# EAGLE design Ninja Sensors (EAGLE 5.11)
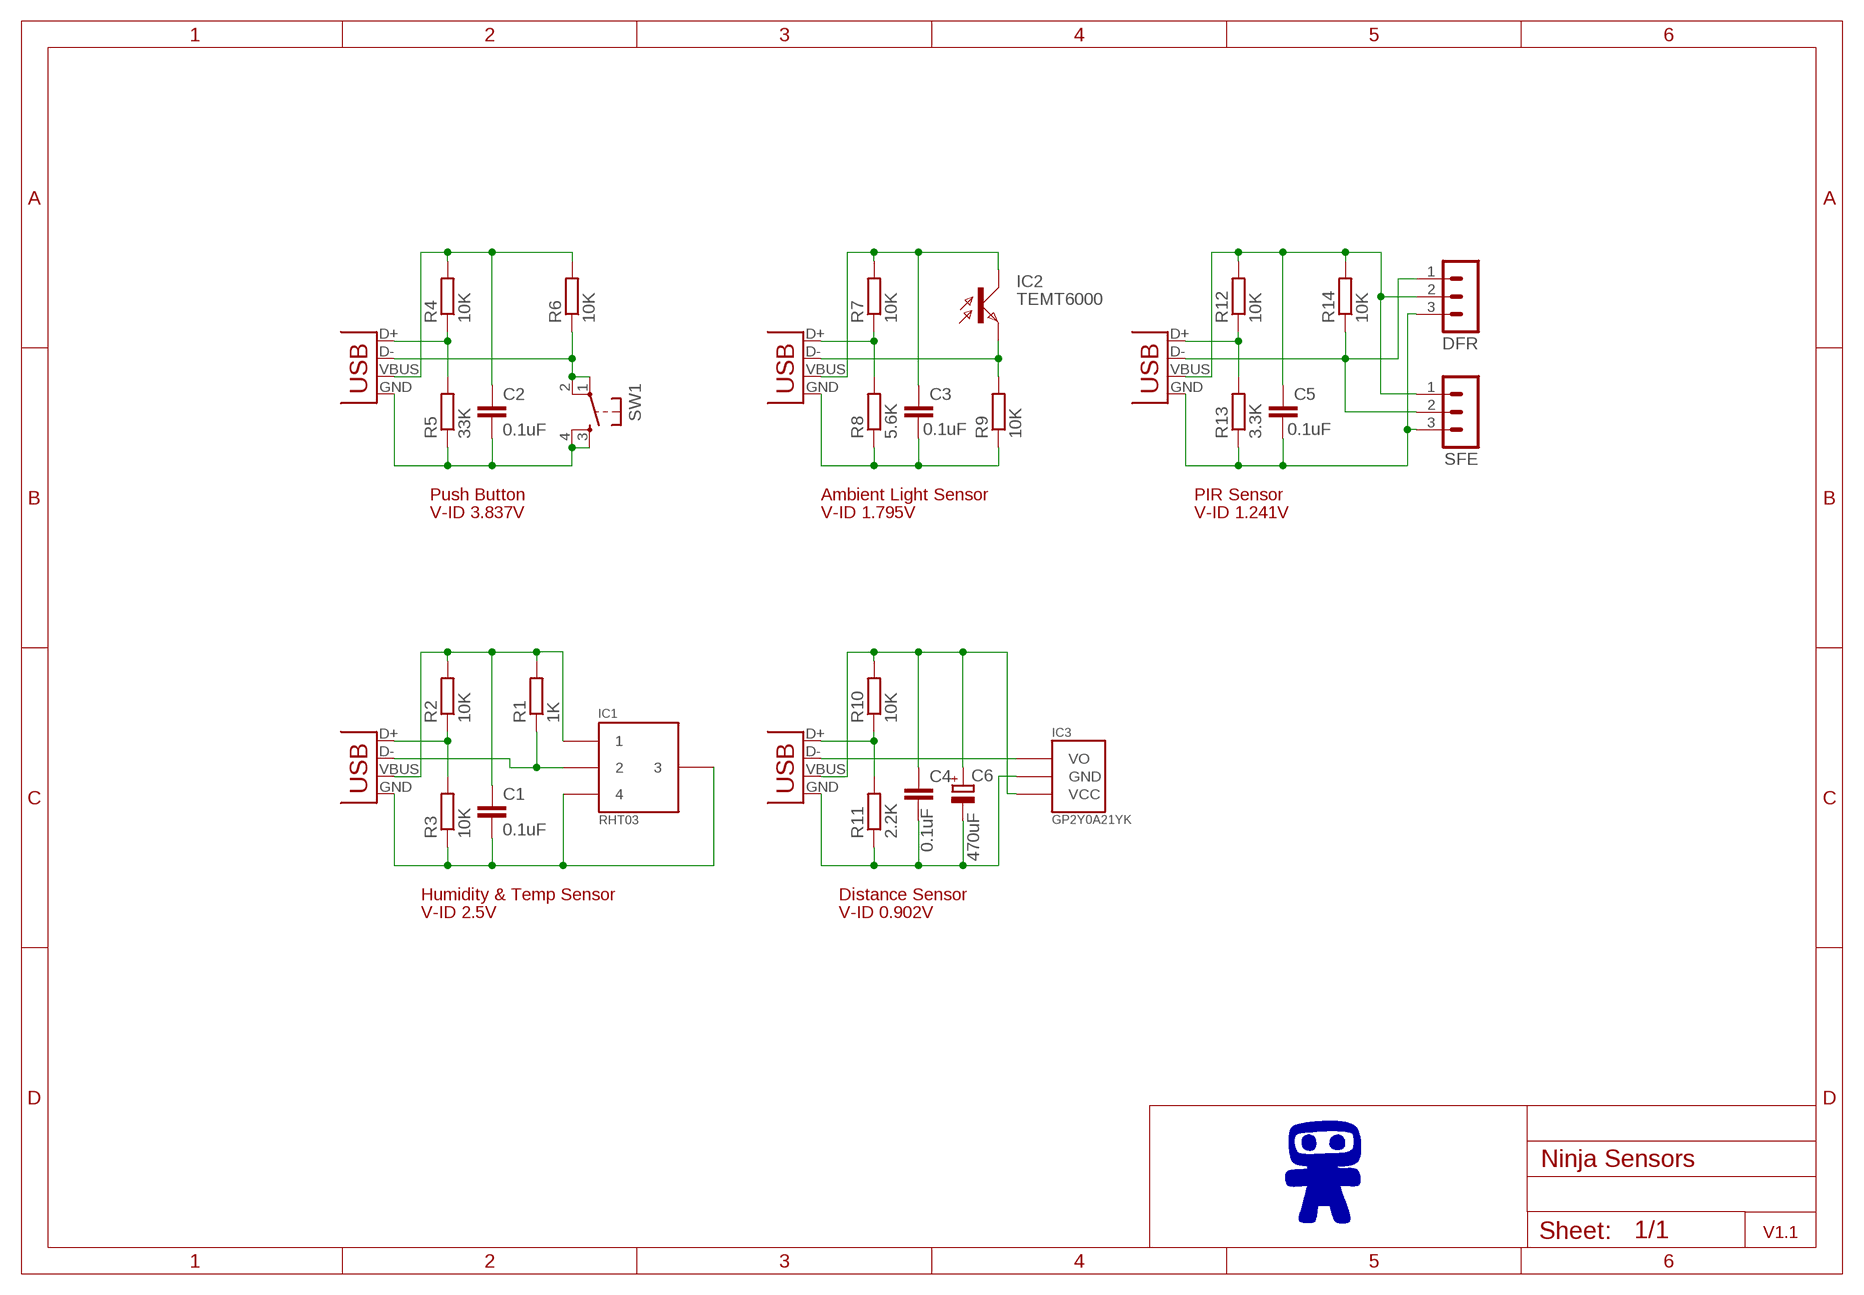
[diagram p0: schematic, sheet 1]

## Parts
C1  0.1uF  C-EUC0603  [C0603]
C2  0.1uF  C-EUC0603  [C0603]
C3  0.1uF  C-EUC0603  [C0603]
C4  0.1uF  C-EUC0603  [C0603]
C5  0.1uF  C-EUC0603  [C0603]
C6  470uF  CPOL-EUE3.5-8  [E3,5-8]
DFR  MA03-1  [MA03-1]
IC1  RHT03  [RHT03]
IC2  TEMT6000  [TEMT6000]
IC3  GP2Y0A21YK  [GP2Y0A21YK]
R1  1K  R-EU_R0603  [R0603]
R2  10K  R-EU_R0603  [R0603]
R3  10K  R-EU_R0603  [R0603]
R4  10K  R-EU_R0603  [R0603]
R5  33K  R-EU_R0603  [R0603]
R6  10K  R-EU_R0603  [R0603]
R7  10K  R-EU_R0603  [R0603]
R8  5.6K  R-EU_R0603  [R0603]
R9  10K  R-EU_R0603  [R0603]
R10  10K  R-EU_R0603  [R0603]
R11  2.2K  R-EU_R0603  [R0603]
R12  10K  R-EU_R0603  [R0603]
R13  3.3K  R-EU_R0603  [R0603]
R14  10K  R-EU_R0603  [R0603]
SFE  MA03-1  [MA03-1]
SW1  SCHURTER_PUSH_BUTTONSC203  [SC203]
X1  USB_  [USB-A-S-SILK-FEMALE]
X2  USB_  [USB-A-S-SILK-FEMALE]
X3  USB_  [USB-A-S-SILK-FEMALE]
X4  USB_  [USB-A-S-SILK-FEMALE]
X5  USB_  [USB-A-S-SILK-FEMALE]

## Nets
N$1: C2.1 R4.2 R6.2 X2.VBUS
N$2: R2.1 R3.2 X1.D+
N$3: C1.1 IC1.P$1 R1.2 R2.2 X1.VBUS
N$4: R4.1 R5.2 X2.D+
N$5: C1.2 IC1.P$3 IC1.P$4 R3.1 X1.GND
N$6: IC1.P$2 R1.1 X1.D-
N$7: C3.1 IC2.C R7.2 X3.VBUS
N$8: R6.1 SW1.1 SW1.2 X2.D-
N$9: R7.1 R8.2 X3.D+
N$10: C2.2 R5.1 SW1.3 SW1.4 X2.GND
N$11: IC2.E R9.2 X3.D-
N$12: C3.2 R8.1 R9.1 X3.GND
N$13: C4.1 C6.+ IC3.P$3(VCC) R10.2 X4.VBUS
N$14: R10.1 R11.2 X4.D+
N$15: IC3.P$1(VO) X4.D-
N$16: C4.2 C6.- IC3.P$2(GND) R11.1 X4.GND
N$17: C5.1 DFR.2 R12.2 R14.2 SFE.1 X5.VBUS
N$18: R12.1 R13.2 X5.D+
N$19: DFR.1 R14.1 SFE.2 X5.D-
N$20: C5.2 DFR.3 R13.1 SFE.3 X5.GND

## Notes on the sheet
- Push Button | Ambient Light Sensor | PIR Sensor
- V-ID 3.837V | V-ID 1.795V | V-ID 1.241V
- Humidity & Temp Sensor | Distance Sensor
- V-ID 2.5V | V-ID 0.902V
- V1.1

## Library data of the parts
C1-C5 = resistor:C-EU: CAPACITOR, European symbol
C6 = rcl:CPOL-EU: POLARIZED CAPACITOR, European symbol
DFR SFE = con-lstb:MA03-1: PIN HEADER; OC_FARNELL: unknown; OC_NEWARK: unknown
IC1 = Monkey:RHT03
IC2 = Monkey:TEMT6000
IC3 = Monkey:GP2Y0A21YK
R1-R14 = resistor:R-EU_: RESISTOR, European symbol
SW1 = Monkey:SCHURTER_PUSH_BUTTON: SCHURTER - 1301.9316 - SWITCH, SMD, PUSH, 7MM Datasheet : http://www.schurterinc.com/pdf/english/typ_lph.pdf
X1-X5 = SparkFun:USB: USB Connectors USB-B-PTH is fully proven SKU : PRT-00139 USB-miniB is fully proven SKU : PRT-00587 USB-A-PCB is untested. USB-A-H is throughly reviewed, but untested. Spark Fun Electronics SKU : PRT-00437 USB-B-SMT is throughly reviewed, but untested. Needs silkscreen touching up. USB-A-S has not been used/tested USB-MB-H has not been used/tested

## Board
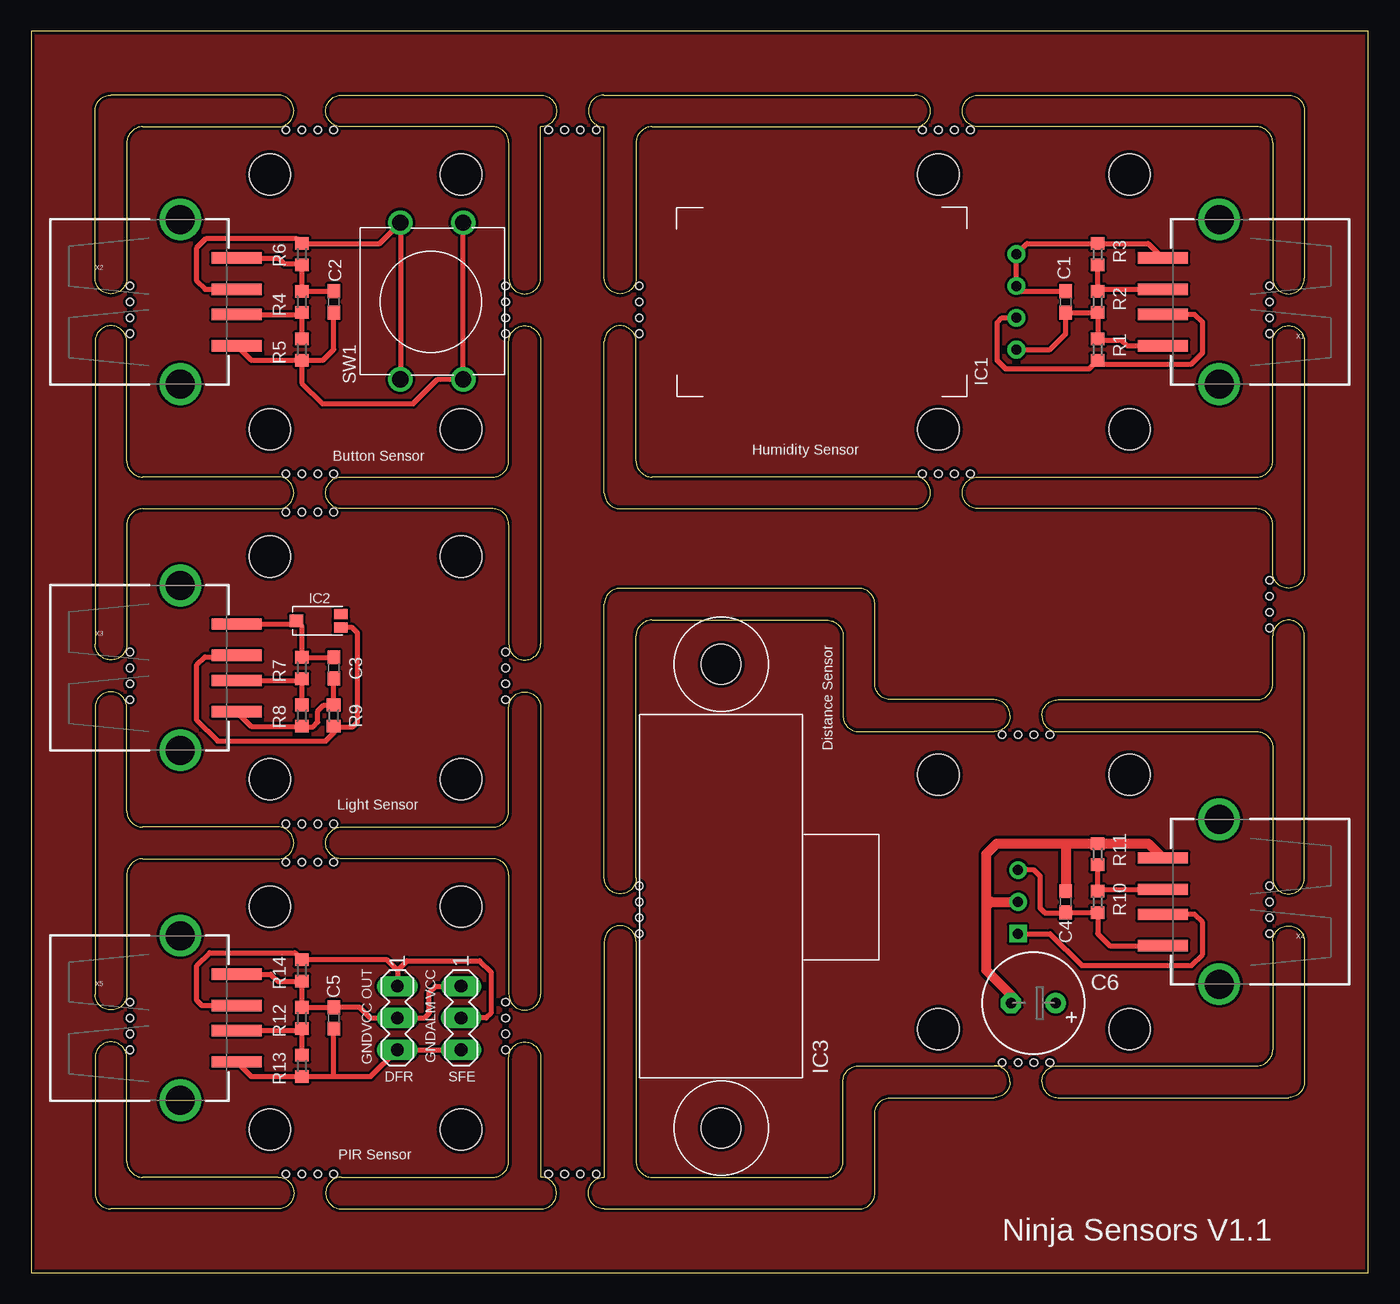
[diagram p1: board, top side]
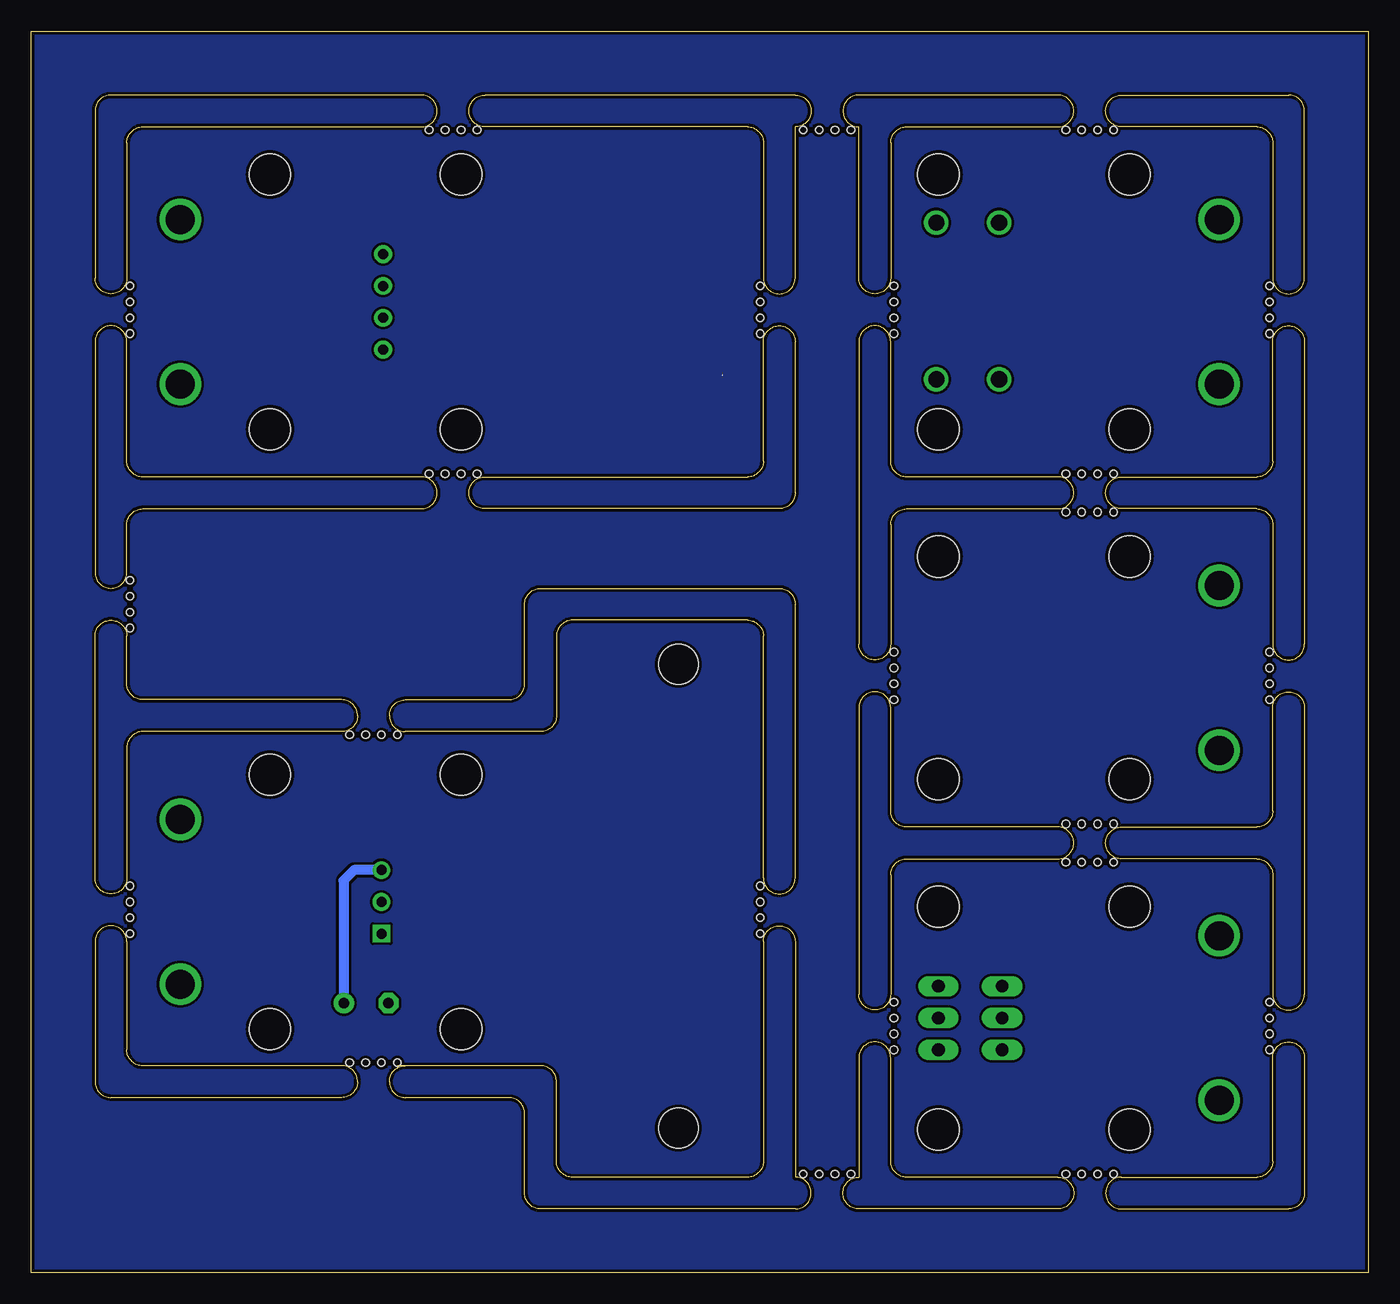
[diagram p2: board, bottom side, seen from below]

Size 106.68 x 99.06 mm. Coordinates in mm from the lower left corner, seen from the top.
Outline: 76.84,16.51 arc-90 78.11,15.24 arc-90 76.84,13.97 68.58,13.97 arc90 67.31,12.7 67.31,6.35 arc-90 66.04,5.08 45.72,5.08 arc-90 44.45,6.35 arc-90 45.72,7.62 45.72,26.42 arc-90 46.99,27.69 arc-90 48.26,26.42 48.26,8.89 arc90 49.53,7.62 63.5,7.62 arc90 64.77,8.89 64.77,15.24 arc-90 66.04,16.51 77.47,16.51
Outline: 8.89,33.02 arc90 7.62,31.75 7.62,22.23 arc-90 6.35,20.96 arc-90 5.08,22.23 5.08,45.09 arc-90 6.35,46.35 arc-90 7.62,45.09 7.62,36.83 arc90 8.89,35.56 19.68,35.56 arc-90 20.96,34.29 arc-90 19.68,33.02 8.89,33.02
Outline: 7.62,8.89 arc90 8.89,7.62 19.68,7.62 arc-90 20.96,6.35 arc-90 19.68,5.08 6.35,5.08 arc-90 5.08,6.35 5.08,17.14 arc-90 6.35,18.41 arc-90 7.62,17.14 7.62,8.89
Outline: 36.83,7.62 arc90 38.1,8.89 38.1,17.14 arc-90 39.37,18.41 arc-90 40.64,17.14 40.64,7.62 arc-90 41.91,6.35 arc-90 40.64,5.08 24.77,5.08 arc-90 23.5,6.35 arc-90 24.77,7.62 36.83,7.62
Outline: 38.1,31.75 arc90 36.83,33.02 24.77,33.02 arc-90 23.5,34.29 arc-90 24.77,35.56 36.83,35.56 arc90 38.1,36.83 38.1,45.09 arc-90 39.37,46.35 arc-90 40.64,45.09 40.64,22.23 arc-90 39.37,20.96 arc-90 38.1,22.23 38.1,31.75
Outline: 8.89,60.96 arc90 7.62,59.69 7.62,50.16 arc-90 6.35,48.89 arc-90 5.08,50.16 5.08,74.3 arc-90 6.35,75.56 arc-90 7.62,74.3 7.62,64.77 arc90 8.89,63.5 19.68,63.5 arc-90 20.96,62.23 arc-90 19.68,60.96 8.89,60.96
Outline: 38.1,59.69 arc90 36.83,60.96 24.77,60.96 arc-90 23.5,62.23 arc-90 24.77,63.5 36.83,63.5 arc90 38.1,64.77 38.1,74.3 arc-90 39.37,75.56 arc-90 40.64,74.3 40.64,50.16 arc-90 39.37,48.89 arc-90 38.1,50.16 38.1,59.69
Outline: 8.89,91.44 arc90 7.62,90.17 7.62,79.38 arc-90 6.35,78.11 arc-90 5.08,79.38 5.08,92.71 arc-90 6.35,93.98 19.68,93.98 arc-90 20.96,92.71 arc-90 19.68,91.44 8.89,91.44
Outline: 38.1,90.17 arc90 36.83,91.44 24.77,91.44 arc-90 23.5,92.71 arc-90 24.77,93.98 40.64,93.98 arc-90 41.91,92.71 arc-90 40.64,91.44 40.64,79.38 arc-90 39.37,78.11 arc-90 38.1,79.38 38.1,90.17
Outline: 49.53,91.44 arc90 48.26,90.17 48.26,79.38 arc-90 46.99,78.11 arc-90 45.72,79.38 45.72,91.44 arc-90 44.45,92.71 arc-90 45.72,93.98 70.48,93.98 arc-90 71.76,92.71 arc-90 70.48,91.44 49.53,91.44
Outline: 48.26,64.77 arc90 49.53,63.5 70.48,63.5 arc-90 71.76,62.23 arc-90 70.48,60.96 46.99,60.96 arc-90 45.72,62.23 45.72,74.3 arc-90 46.99,75.56 arc-90 48.26,74.3 48.26,64.77
Outline: 97.79,63.5 arc90 99.06,64.77 99.06,74.3 arc-90 100.33,75.56 arc-90 101.6,74.3 101.6,55.88 arc-90 100.33,54.61 arc-90 99.06,55.88 99.06,59.69 arc90 97.79,60.96 75.56,60.96 arc-90 74.3,62.23 arc-90 75.56,63.5 97.79,63.5
Outline: 99.06,90.17 arc90 97.79,91.44 75.56,91.44 arc-90 74.3,92.71 arc-90 75.56,93.98 100.33,93.98 arc-90 101.6,92.71 101.6,79.38 arc-90 100.33,78.11 arc-90 99.06,79.38 99.06,90.17
Outline: 49.53,52.07 arc90 48.26,50.8 48.26,31.5 arc-90 46.99,30.23 arc-90 45.72,31.5 45.72,53.34 arc-90 46.99,54.61 66.04,54.61 arc-90 67.31,53.34 67.31,46.99 arc90 68.58,45.72 76.84,45.72 arc-90 78.11,44.45 arc-90 76.84,43.18 66.04,43.18 arc-90 64.77,44.45 64.77,50.8 arc90 63.5,52.07 49.53,52.07
Outline: 80.65,44.45 arc90 81.92,43.18 97.79,43.18 arc-90 99.06,41.91 99.06,31.5 arc90 100.33,30.23 arc90 101.6,31.5 101.6,50.8 arc90 100.33,52.07 arc90 99.06,50.8 99.06,46.99 arc-90 97.79,45.72 81.92,45.72 arc90 80.65,44.45
Outline: 80.65,15.24 arc-90 81.92,16.51 97.79,16.51 arc90 99.06,17.78 99.06,26.42 arc-90 100.33,27.69 arc-90 101.6,26.42 101.6,15.24 arc-90 100.33,13.97 81.92,13.97 arc-90 80.65,15.24
Outline: 0,99.06 0,0 106.68,0 106.68,99.06 0,99.06
Copper layers (1*16): Top 0.035mm / dielectric 1.5mm / Bottom 0.035mm
Design rules "SparkFun": minimum track width 8mil, minimum drill 20mil, track to track 8mil, track to pad 8mil, pad to pad 8mil, via to via 8mil, smd to smd 8mil, copper to edge 10mil, drill to drill 8mil, minimum pad ring 12mil, minimum via ring 10mil, stop-mask expansion 4mil, vias tented up to drill 25mil, thermal gap 10mil
Holes 0.6 mm at 22.86,32.77 21.59,32.77 20.32,32.77 24.13,32.77 37.85,20.32 37.85,21.59 37.85,19.05 37.85,17.78 7.87,20.32 7.87,19.05 7.87,17.78 7.87,21.59 22.86,7.87 24.13,7.87 21.59,7.87 20.32,7.87 22.86,35.81 21.59,35.81 20.32,35.81 24.13,35.81 37.85,48.26 37.85,49.53 37.85,46.99 37.85,45.72 7.87,48.26 7.87,46.99 7.87,45.72 7.87,49.53 22.86,60.71 21.59,60.71 20.32,60.71 24.13,60.71 22.86,63.75 21.59,63.75 20.32,63.75 24.13,63.75 37.85,77.47 37.85,78.74 37.85,76.2 37.85,74.93 7.87,77.47 7.87,76.2 7.87,74.93 7.87,78.74 22.86,91.19 21.59,91.19 20.32,91.19 24.13,91.19 48.51,77.47 48.51,76.2 48.51,74.93 48.51,78.74 48.51,29.59 48.51,28.32 48.51,27.05 48.51,30.86 73.66,91.19 72.39,91.19 71.12,91.19 74.93,91.19 73.66,63.75 72.39,63.75 71.12,63.75 74.93,63.75 80.01,42.93 81.28,42.93 78.74,42.93 77.47,42.93 80.01,16.76 78.74,16.76 77.47,16.76 81.28,16.76 98.81,77.47 98.81,78.74 98.81,76.2 98.81,74.93 98.81,29.59 98.81,30.86 98.81,28.32 98.81,27.05 43.81,91.19 45.09,91.19 42.54,91.19 41.27,91.19 42.54,7.87 41.27,7.87 43.81,7.87 45.09,7.87 98.81,52.7 98.81,51.43 98.81,53.97 98.81,55.24

### Footprints (pad centres in the part's own frame; a part is rotated, then mirrored left to right if it is on the bottom)
C0603 = smd 1.1 x 1: 1 -0.85,0; 2 0.85,0
E3,5-8 = drill 0.813 pad 1.6 round: + -1.778,0 | drill 0.813 pad 1.6 octagon: - 1.778,0
MA03-1 = drill 1.016 long: 1 -2.54,0; 2 0,0; 3 2.54,0
RHT03 = drill 0.8 round: P$1 0,0; P$2 2.54,0; P$3 5.08,0; P$4 7.62,0
TEMT6000 = smd 1.1 x 1: C 1.7,0.05 | smd 1.1 x 0.8: E -1.85,0.6; P$2 -1.85,-0.5
GP2Y0A21YK = drill 0.8 square: P$1 -2.54,-13.97 | drill 0.8 round: P$2 0,-13.97; P$3 2.54,-13.97 | hole 3.2: -18.04,9.73; 18.96,9.73
R0603 = smd 1 x 1.1: 1 -0.85,0; 2 0.85,0
SC203 = drill 1.3 round: 1 -6.18,2.29; 2 6.32,2.29; 3 -6.18,-2.71; 4 6.32,-2.71
STAND-OFF = hole 3.302: 0,0
USB-A-S-SILK-FEMALE = smd 4 x 0.9: D+ 7.5,-1; D- 7.5,1; GND 7.5,-3.5; VBUS 7.5,3.5 | drill 2.311 round: P$5 3,-6.57; P$6 3,6.57

### Placement (x,y rotation side)
C1  82.55,77.47 90 top
C2  24.13,77.47 270 top
C3  24.13,48.26 270 top
C4  82.55,29.59 90 top
C5  24.13,20.32 270 top
C6  79.96,21.51 180 top
DFR  29.21,20.32 270 top
IC1  78.61,73.66 90 top
IC2  22.86,52.07 180 top
IC3  64.77,29.59 90 top
R1  85.09,73.66 90 top
R2  85.09,77.47 270 top
R3  85.09,81.28 270 top
R4  21.59,77.47 90 top
R5  21.59,73.66 90 top
R6  21.59,81.28 270 top
R7  21.59,48.26 90 top
R8  21.59,44.45 90 top
R9  24.13,44.45 270 top
R10  85.09,29.59 270 top
R11  85.09,33.4 270 top
R12  21.59,20.32 90 top
R13  21.59,16.51 90 top
R14  21.59,24.13 270 top
SFE  34.29,20.32 270 top
SW1  31.75,77.47 90 top
U$1  [STAND-OFF]  19.05,57.15 270 top
U$2  [STAND-OFF]  19.05,29.21 270 top
U$3  [STAND-OFF]  19.05,39.37 270 top
U$4  [STAND-OFF]  19.05,11.43 270 top
U$5  [STAND-OFF]  34.29,29.21 270 top
U$6  [STAND-OFF]  34.29,11.43 270 top
U$7  [STAND-OFF]  87.63,67.31 90 top
U$8  [STAND-OFF]  87.63,87.63 90 top
U$9  [STAND-OFF]  19.05,87.63 270 top
U$10  [STAND-OFF]  19.05,67.31 270 top
U$11  [STAND-OFF]  34.29,87.63 270 top
U$12  [STAND-OFF]  34.29,67.31 270 top
U$13  [STAND-OFF]  72.39,67.31 90 top
U$14  [STAND-OFF]  72.39,87.63 90 top
U$15  [STAND-OFF]  34.29,57.15 270 top
U$16  [STAND-OFF]  34.29,39.37 270 top
U$17  [STAND-OFF]  87.63,19.43 90 top
U$18  [STAND-OFF]  87.63,39.75 90 top
U$19  [STAND-OFF]  72.39,19.43 90 top
U$20  [STAND-OFF]  72.39,39.75 90 top
X1  97.79,77.47 180 top
X2  8.89,77.47 0 top
X3  8.89,48.26 0 top
X4  97.79,29.59 180 top
X5  8.89,20.32 0 top

### Tracks (layer width: path | path; a pad name or v marks a point on that pad's centre or on a via)
N$1
  Top 0.406: X2.VBUS 19.74,80.97 20.19,80.52 21.5,80.52 R6.2 R4.2 C2.1
N$2
  Top 0.406: R3.2 R2.1 85.24,78.47 X1.D+
N$3
  Top 0.406: X1.VBUS 87.45,73.97 87,74.42 85.18,74.42 R1.2 R2.2 C1.1 82.55,74.93 81.28,73.66 IC1.P$1
N$4
  Top 0.406: R5.2 R4.1 21.44,76.47 X2.D+
N$5
  Top 0.406: X1.GND 89.13,82.13 R3.1 79.46,82.13 IC1.P$4 IC1.P$3 79.03,78.32 C1.2
N$6
  Top 0.406: X1.D- 92.82,76.47 93.47,75.82 93.47,73.41 92.58,72.52 85.38,72.52 R1.1 84.42,72.14 77.72,72.14 77.09,72.77 77.09,75.82 77.47,76.2 IC1.P$2
N$7
  Top 0.406: C3.1 R7.2 21.59,51.59 IC2.C 20.9,51.76 X3.VBUS
N$8
  Top 0.406: X2.D- 13.86,78.47 13.21,79.12 13.21,81.79 13.97,82.55 21.17,82.55 R6.1 27.8,82.13 SW1.2 SW1.1
N$9
  Top 0.406: R8.2 R7.1 21.44,47.26 X3.D+
N$10
  Top 0.406: SW1.4 SW1.3 32.43,71.29 30.48,69.34 23.24,69.34 21.59,70.99 R5.1 | R5.1 17.55,72.81 X2.GND | R5.1 23.28,72.81 24.13,73.66 C2.2
N$11
  Top 0.406: IC2.E 25.62,51.47 26.04,51.05 26.04,43.94 25.65,43.56 24.17,43.56 R9.2 24.13,43.05 23.5,42.42 14.86,42.42 13.21,44.07 13.21,48.51 13.84,49.15 16.28,49.15 X3.D-
N$12
  Top 0.254: R8.1 21.63,43.56
  Top 0.406: R8.1 17.55,43.6 X3.GND | C3.2 R9.1 23.33,45.3 22.86,44.83 22.86,43.94 22.48,43.56 21.63,43.56
N$13
  Top 0.406: X4.VBUS 86.05,26.09 85.09,27.05 R10.2 C4.1 82.51,28.7 80.9,28.7 80.52,29.08 80.52,31.62 80.01,32.13 IC3.P$3
  Bottom 0.406: 81.76,21.54 C6.+
  Bottom 0.813: IC3.P$3 80.92,32.13 81.76,31.29 81.76,21.54
N$14
  Top 0.406: R11.2 R10.1 85.24,30.59 X4.D+
N$15
  Top 0.406: X4.D- 92.82,28.59 93.47,27.94 93.47,25.4 92.58,24.51 83.82,24.51 81.28,27.05 IC3.P$1
N$16
  Top 0.813: X4.GND 89.13,34.25 R11.1 82.55,34.25 | 82.55,34.25 77.05,34.25 76.2,33.4 76.2,29.21 | 82.55,34.25 C4.2 | C6.- 78.18,22.15 76.2,24.13 76.2,29.21 | IC3.P$2 76.58,29.59 76.2,29.21
N$17
  Top 0.406: X5.VBUS 19.11,23.82 19.68,23.24 21.63,23.24 R14.2 R12.2 C5.1 24.17,21.21 26.16,21.21 27.05,20.32 DFR.2 31.37,20.32 31.75,20.7 31.75,22.35 32.26,22.86 SFE.1
N$18
  Top 0.406: R13.2 R12.1 21.44,19.32 X5.D+
N$19
  Top 0.406: SFE.2 36.3,20.32 36.68,20.7 36.68,24 35.79,24.89 29.97,24.89 29.21,24.13 | 29.21,24.13 DFR.1 | X5.D- 13.61,21.32 13.21,21.72 13.21,24.51 14.22,25.53 21.04,25.53 R14.1 28.36,24.98 29.21,24.13
N$20
  Top 0.406: X5.GND 17.55,15.66 R13.1 24.13,15.66 | SFE.3 DFR.3 27.09,15.66 24.13,15.66 | 24.13,15.66 C5.2
N$21
  pour Top: 0,99.06 0,0 106.68,0 106.68,99.06
N$22
  pour Bottom: 0,99.06 0,0 106.68,0 106.68,99.06

### Text on the board
tPlace: Button Sensor | Humidity Sensor | Distance Sensor | Light Sensor | OUT | VCC | VCC | ALM | GND | GND | PIR Sensor | Ninja Sensors V1.1